# EAGLE design PL (EAGLE 9.4.2)
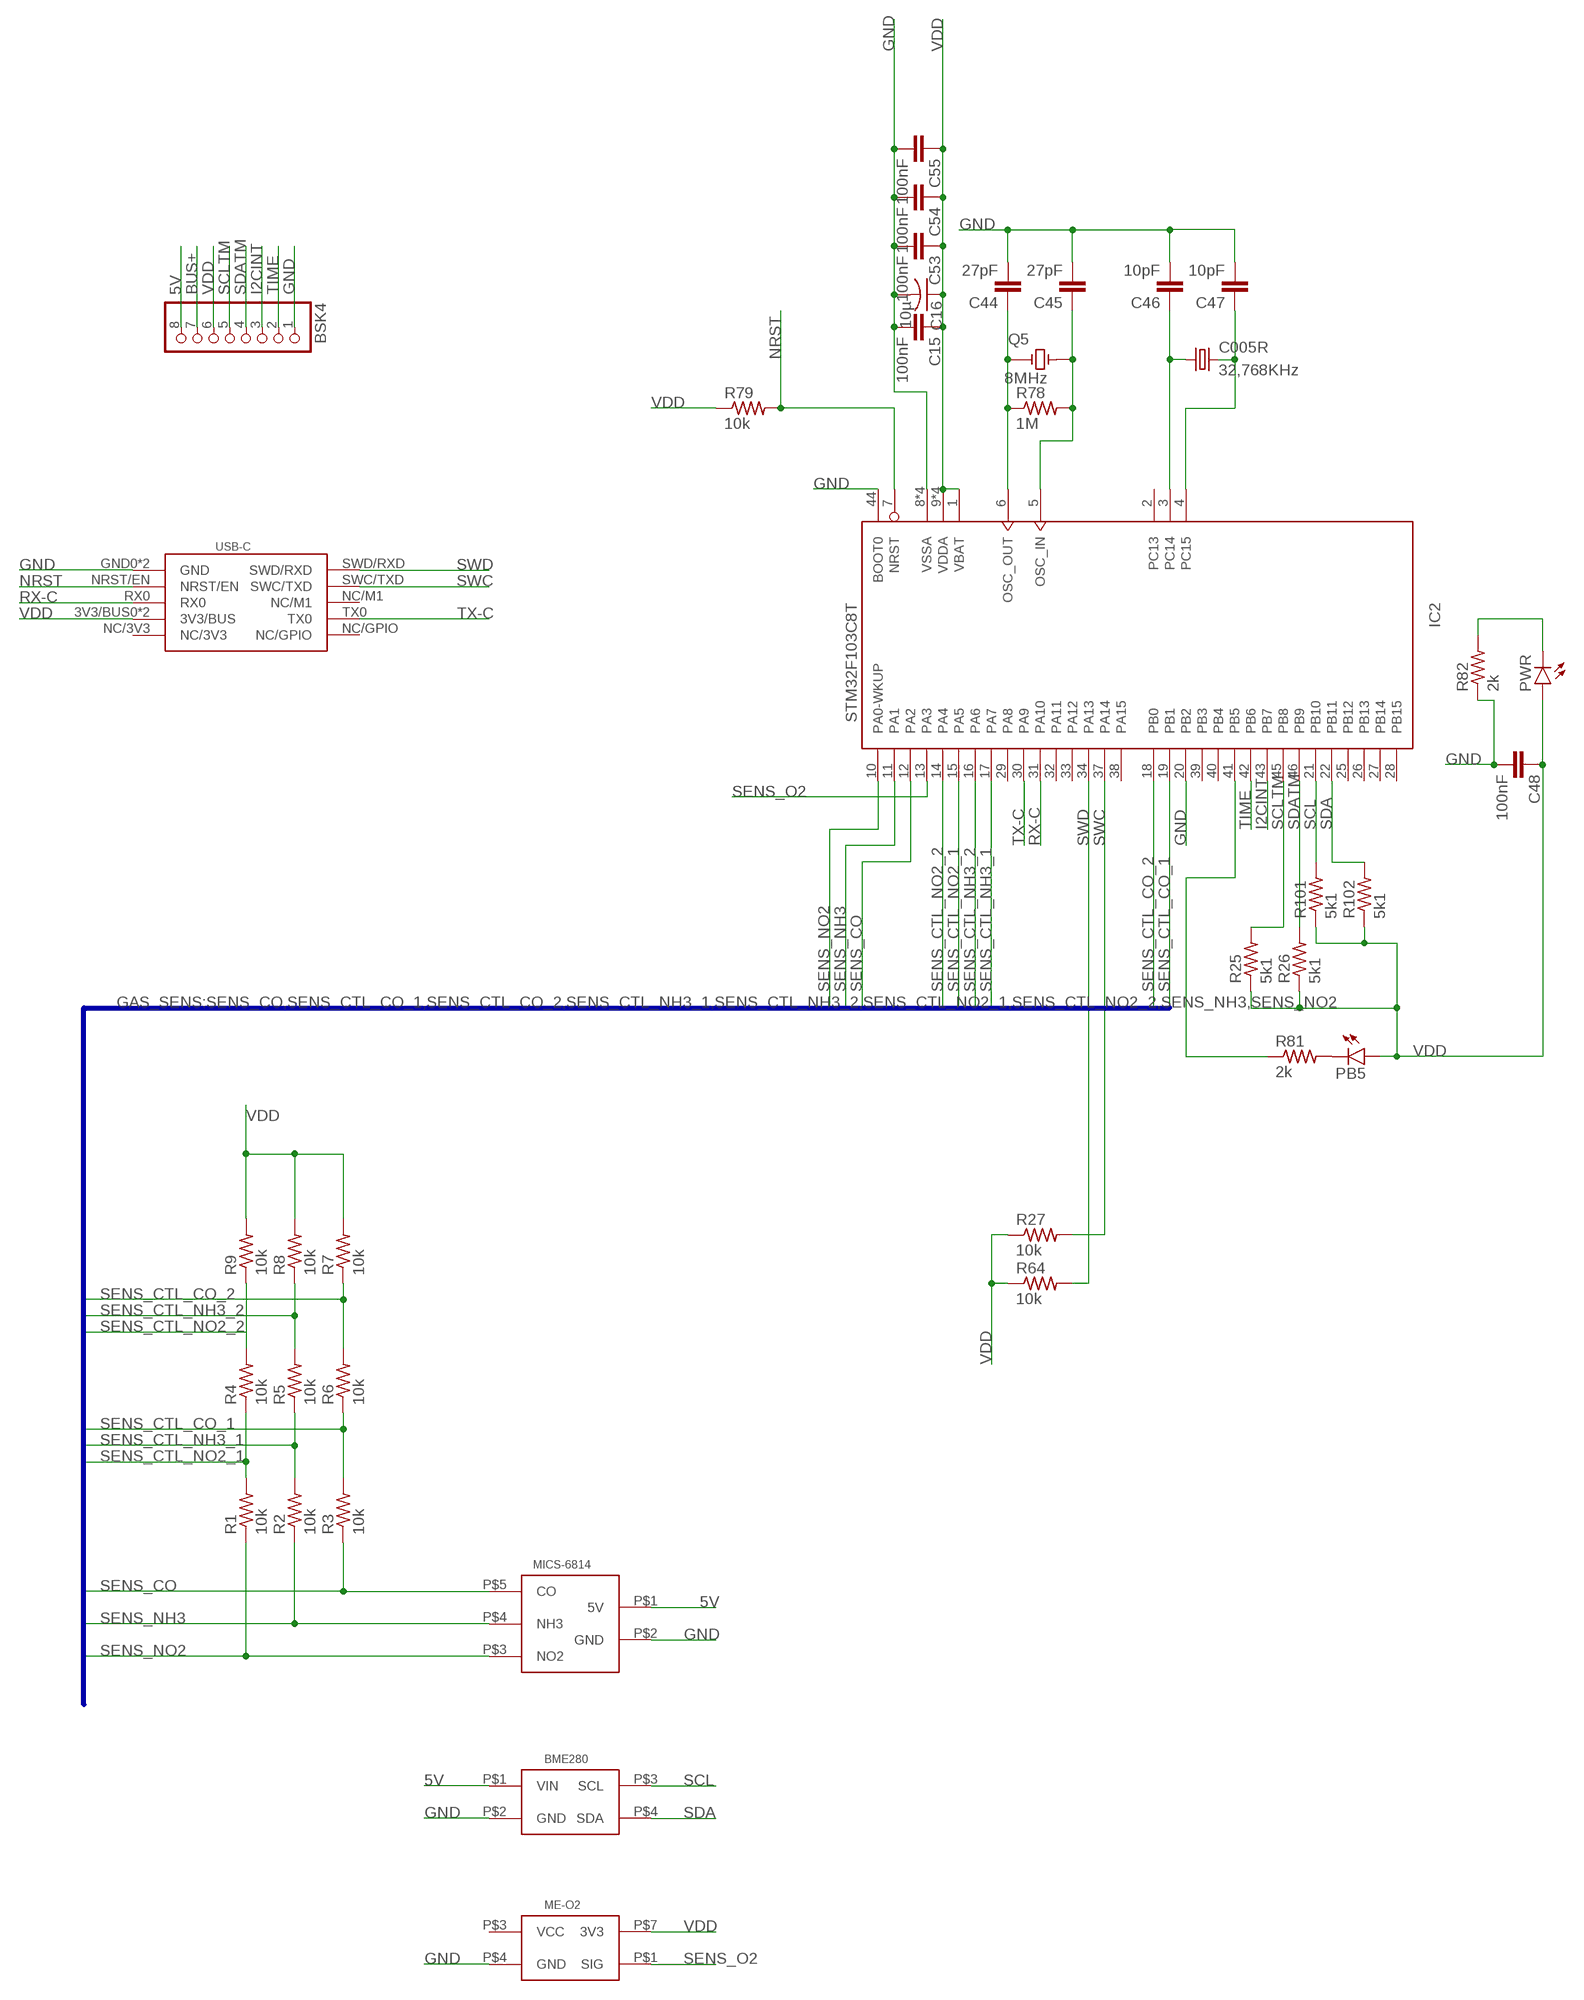
[diagram p0: schematic, sheet 1]

## Parts
BME280  BME280  [BME280]
BSK4  PINHD-1X8  [1X08]
C005R  32,768KHz  C005R  [C005R]
C15  100nF  C-EUC0603  [C0603]
C16  10µ  C-USC1206  [C1206]
C44  27pF  C-EUC0603  [C0603]
C45  27pF  C-EUC0603  [C0603]
C46  10pF  C-EUC0603  [C0603]
C47  10pF  C-EUC0603  [C0603]
C48  100nF  C-EUC0603  [C0603]
C53  100nF  C-EUC0603  [C0603]
C54  100nF  C-EUC0603  [C0603]
C55  100nF  C-EUC0603  [C0603]
IC2  STM32F103C8T  [LQFP48]
ME-O2  ME-O2  [ME-O2]
MICS-6814  MICS-6814  [MICS-6814]
PB5  LEDCHIPLED_0603  [CHIPLED_0603]
PWR  LEDCHIPLED_0603  [CHIPLED_0603]
Q5  8MHz  9C-8.000MEEJ-T  [XTAL_9C-8.000MEEJ-T]
R1  10k  R-US_R0603  [R0603]
R2  10k  R-US_R0603  [R0603]
R3  10k  R-US_R0603  [R0603]
R4  10k  R-US_R0603  [R0603]
R5  10k  R-US_R0603  [R0603]
R6  10k  R-US_R0603  [R0603]
R7  10k  R-US_R0603  [R0603]
R8  10k  R-US_R0603  [R0603]
R9  10k  R-US_R0603  [R0603]
R25  5k1  R-US_R0603  [R0603]
R26  5k1  R-US_R0603  [R0603]
R27  10k  R-US_R0603  [R0603]
R64  10k  R-US_R0603  [R0603]
R78  1M  R-US_R0603  [R0603]
R79  10k  R-US_R0603  [R0603]
R81  2k  R-US_R0603  [R0603]
R82  2k  R-US_R0603  [R0603]
R101  5k1  R-US_R0603  [R0603]
R102  5k1  R-US_R0603  [R0603]
USB-C  USB-C  [USB-C]

## Nets
5V: BME280.P$1(VIN) BSK4.8 MICS-6814.P$1(5V)
BUS+: BSK4.7
GND: BME280.P$2(GND) BSK4.1 C15.2 C16.2 C44.2 C45.2 C46.2 C47.2 C48.2 C53.2 C54.2 C55.2 IC2.8(VSSA) IC2.20(PB2) IC2.23(VSSA) IC2.35(VSSA) IC2.44(BOOT0) IC2.47(VSSA) ME-O2.P$4(GND) MICS-6814.P$2(GND) R82.1 USB-C.GND0(GND) USB-C.GND1(GND)
I2CINT: BSK4.3 IC2.43(PB7)
N$1: PB5.C R81.2
N$133: C44.1 IC2.6(OSC_OUT) Q5.1 R78.1
N$145: C45.1 IC2.5(OSC_IN) Q5.2 R78.2
N$148: C005R.P$2 C47.1 IC2.4(PC15)
N$152: C005R.P$1 C46.1 IC2.3(PC14)
N$159: PWR.C R82.2
N$161: IC2.41(PB5) R81.1
NRST: IC2.7(NRST) R79.2 USB-C.NRST/EN
RX-C: IC2.31(PA10) USB-C.RX0
SCL: BME280.P$3(SCL) IC2.21(PB10) R101.2
SCLTM: BSK4.5 IC2.45(PB8) R25.2
SDA: BME280.P$4(SDA) IC2.22(PB11) R102.2
SDATM: BSK4.4 IC2.46(PB9) R26.2
SENS_CO: IC2.12(PA2) MICS-6814.P$5(CO) R3.1
SENS_CTL_CO_1: IC2.19(PB1) R3.2 R6.1
SENS_CTL_CO_2: IC2.18(PB0) R6.2 R7.1
SENS_CTL_NH3_1: IC2.17(PA7) R2.2 R5.1
SENS_CTL_NH3_2: IC2.16(PA6) R5.2 R8.1
SENS_CTL_NO2_1: IC2.15(PA5) R1.2 R4.1
SENS_CTL_NO2_2: IC2.14(PA4) R4.2 R9.1
SENS_NH3: IC2.11(PA1) MICS-6814.P$4(NH3) R2.1
SENS_NO2: IC2.10(PA0-WKUP) MICS-6814.P$3(NO2) R1.1
SENS_O2: IC2.13(PA3) ME-O2.P$1(SIG)
SWC: IC2.37(PA14) R27.2 USB-C.SWC/TXD
SWD: IC2.34(PA13) R64.2 USB-C.SWD/RXD
TIME: BSK4.2 IC2.42(PB6)
TX-C: IC2.30(PA9) USB-C.TX0
VDD: BSK4.6 C15.1 C16.1 C48.1 C53.1 C54.1 C55.1 IC2.1(VBAT) IC2.9(VDDA) IC2.24(VDDA) IC2.36(VDDA) IC2.48(VDDA) ME-O2.P$7(3V3) PB5.A PWR.A R7.2 R8.2 R9.2 R25.1 R26.1 R27.1 R64.1 R79.1 R101.1 R102.1 USB-C.3V3/BUS0(3V3/BUS) USB-C.3V3/BUS1(3V3/BUS)
Unconnected: IC2.2(PC13) IC2.25(PB12) IC2.26(PB13) IC2.27(PB14) IC2.28(PB15) IC2.29(PA8) IC2.32(PA11) IC2.33(PA12) IC2.38(PA15) IC2.39(PB3) IC2.40(PB4) ME-O2.P$3(VCC) USB-C.NC/3V3 USB-C.NC/GPIO USB-C.NC/M1

## Buses
GAS_SENS:SENS_CO,SENS_CTL_CO_1,SENS_CTL_CO_2,SENS_CTL_NH3_1,SENS_CTL_NH3_2,SENS_CTL_NO2_1,SENS_CTL_NO2_2,SENS_NH3,SENS_NO2

## Library data of the parts
BME280 = CanCubeSat:BME280
BSK4 = pinheadCS:PINHD-1X8: PIN HEADER
C005R = CanCubeSat:C005R
C15 C44-C48 C53-C55 = rcl:C-EU: CAPACITOR, European symbol; SPICEPREFIX: C
C16 = rcl:C-US: CAPACITOR, American symbol; SPICEPREFIX: C
IC2 = CanCubeSat:STM32F103C*T: ARM 32-bit Cortex™-M3 CPU 72 MHz maximum frequency 16 to 128 Kbytes of Flash memory 6 to 20 kbytes of SRAM 37 GPIOs 2.0 to 3.6 V application supply
ME-O2 = CanCubeSat:ME-O2
MICS-6814 = CanCubeSat:MICS-6814
PB5 PWR = led:LED: LED OSRAM: - CHIPLED LG R971, LG N971, LY N971, LG Q971, LY Q971, LO R971, LY R971 LH N974, LH R974 LS Q976, LO Q976, LY Q976 LO Q996 - Hyper CHIPLED LW Q18S LB Q993, LB Q99A, LB R99A - SideLED LS A670, LO A670, LY A670, LG A670, LP A670 LB A673, LV A673, LT A673, LW A673 LH A674 LY A675 LS A676, LA A676, LO A676, LY A676, LW A676 LS A679, LY A679, LG A679 - Hyper Micro SIDELED® LS Y876, LA Y876, LO Y876, LY Y876 LT Y87S - SmartLED LW L88C, LW L88S LB L89C, LB L89S, LG L890 LS L89K, LO L89K, LY L89K LS L896, LA L896, LO L896, LY L896 - TOPLED LS T670, LO T670, LY T670, LG T670, LP T670 LSG T670, LSP T670, LSY T670, LOP T670, LYG T670 LG T671, LOG T671, LSG T671 LB T673, LV T673, LT T673, LW T673 LH T674 LS T676, LA T676, LO T676, LY T676, LB T676, LH T676, LSB T676, LW T676 LB T67C, LV T67C, LT T67C, LS T67K, LO T67K, LY T67K, LW E67C LS E67B, LA E67B, LO E67B, LY E67B, LB E67C, LV E67C, LT E67C LW T67C LS T679, LY T679, LG T679 LS T770, LO T770, LY T770, LG T770, LP T770 LB T773, LV T773, LT T773, LW T773 LH T774 LS E675, LA E675, LY E675, LS T675 LS T776, LA T776, LO T776, LY T776, LB T776 LHGB T686 LT T68C, LB T68C - Hyper Mini TOPLED® LB M676 - Mini TOPLED Santana® LG M470 LS M47K, LO M47K, LY M47K Source: http://www.osram.convergy.de LUXEON: - LUMILED® LXK2-PW12-R00, LXK2-PW12-S00, LXK2-PW14-U00, LXK2-PW14-V00 LXK2-PM12-R00, LXK2-PM12-S00, LXK2-PM14-U00 LXK2-PE12-Q00, LXK2-PE12-R00, LXK2-PE12-S00, LXK2-PE14-T00, LXK2-PE14-U00 LXK2-PB12-K00, LXK2-PB12-L00, LXK2-PB12-M00, LXK2-PB14-N00, LXK2-PB14-P00, LXK2-PB14-Q00 LXK2-PR12-L00, LXK2-PR12-M00, LXK2-PR14-Q00, LXK2-PR14-R00 LXK2-PD12-Q00, LXK2-PD12-R00, LXK2-PD12-S00 LXK2-PH12-R00, LXK2-PH12-S00 LXK2-PL12-P00, LXK2-PL12-Q00, LXK2-PL12-R00 Source: www.luxeon.com KINGBRIGHT: KA-3528ASYC Source: www.kingbright.com
Q5 = 9C-8.000MEEJ-T:9C-8.000MEEJ-T: Crystal, 8mhz, 18pf, Hc-49s; AVAILABILITY: Unavailable; DESCRIPTION: Crystal, 8mhz, 18pf, Hc-49s; MF: TXC CORPORATION; MP: 9C-8.000MEEJ-T; PACKAGE: HC49/US TXC; PRICE: None
R1-R9 R25-R27 R64 R78 R79 R81 R82 R101 R102 = resistor:R-US_: RESISTOR, American symbol
USB-C = CanCubeSat:USB-C

## Board
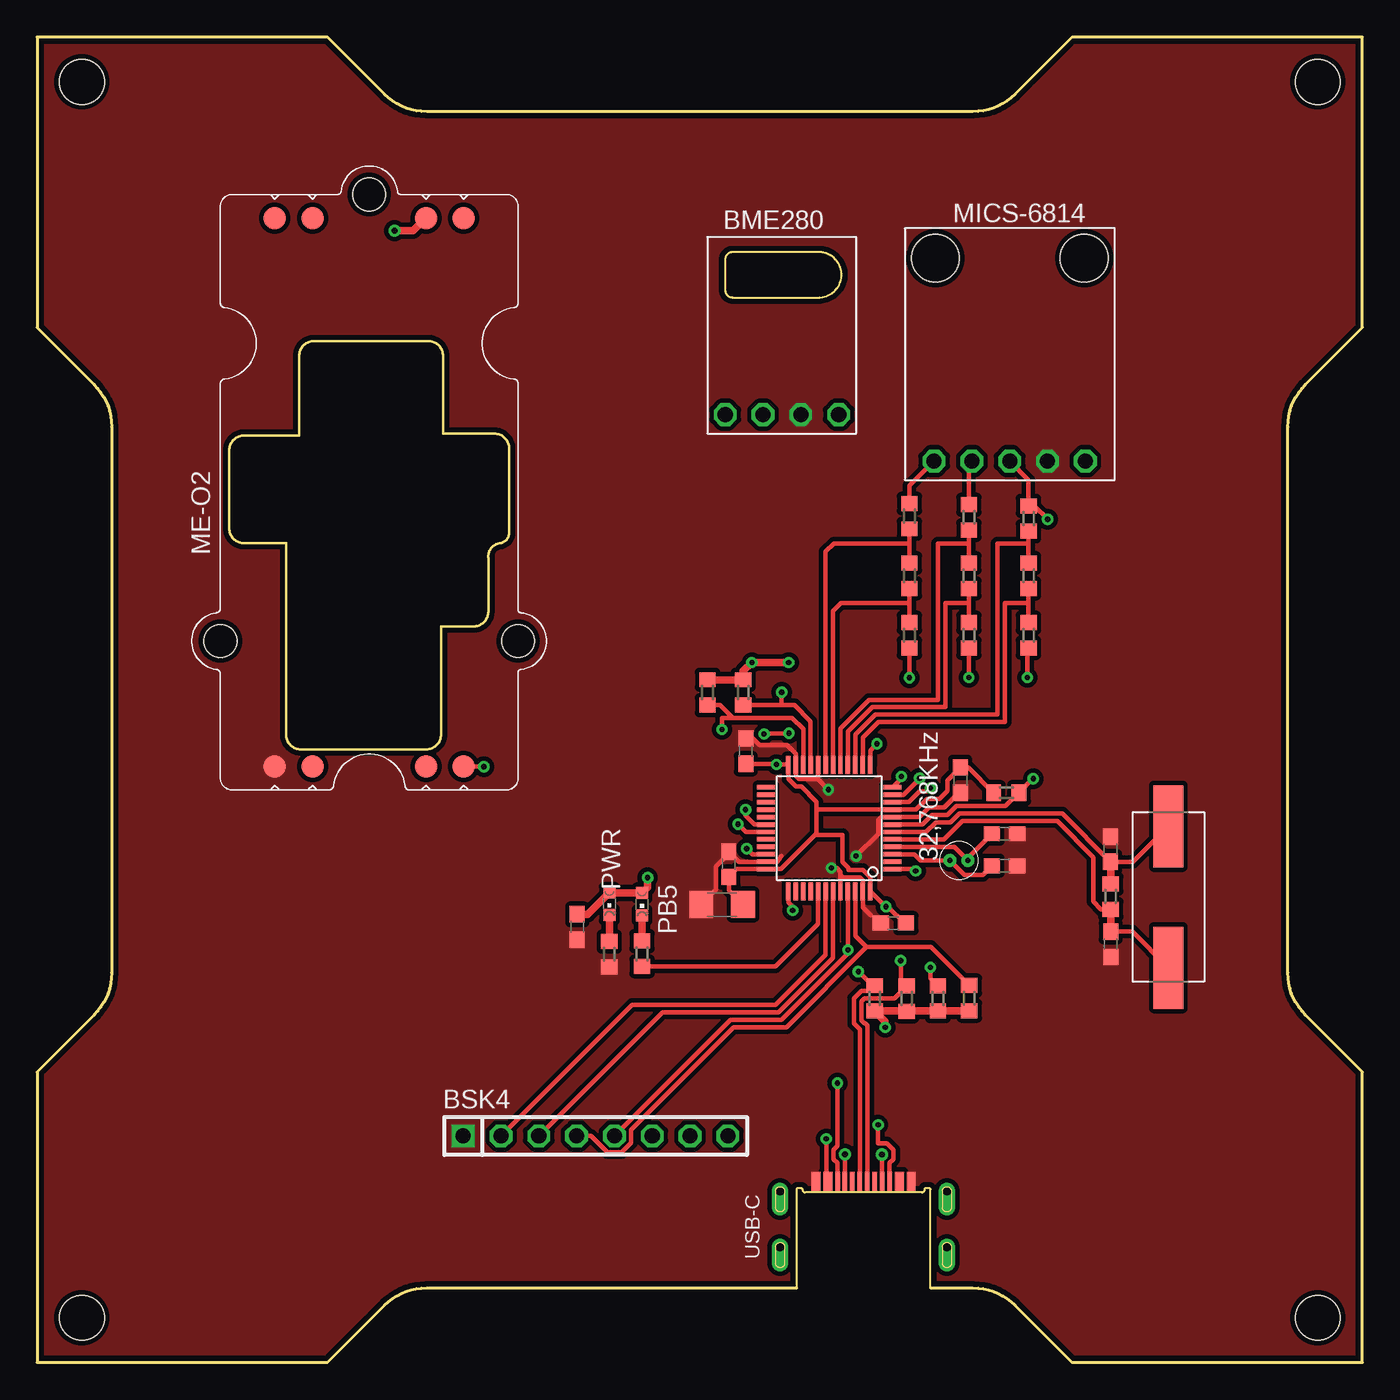
[diagram p1: board, top side]
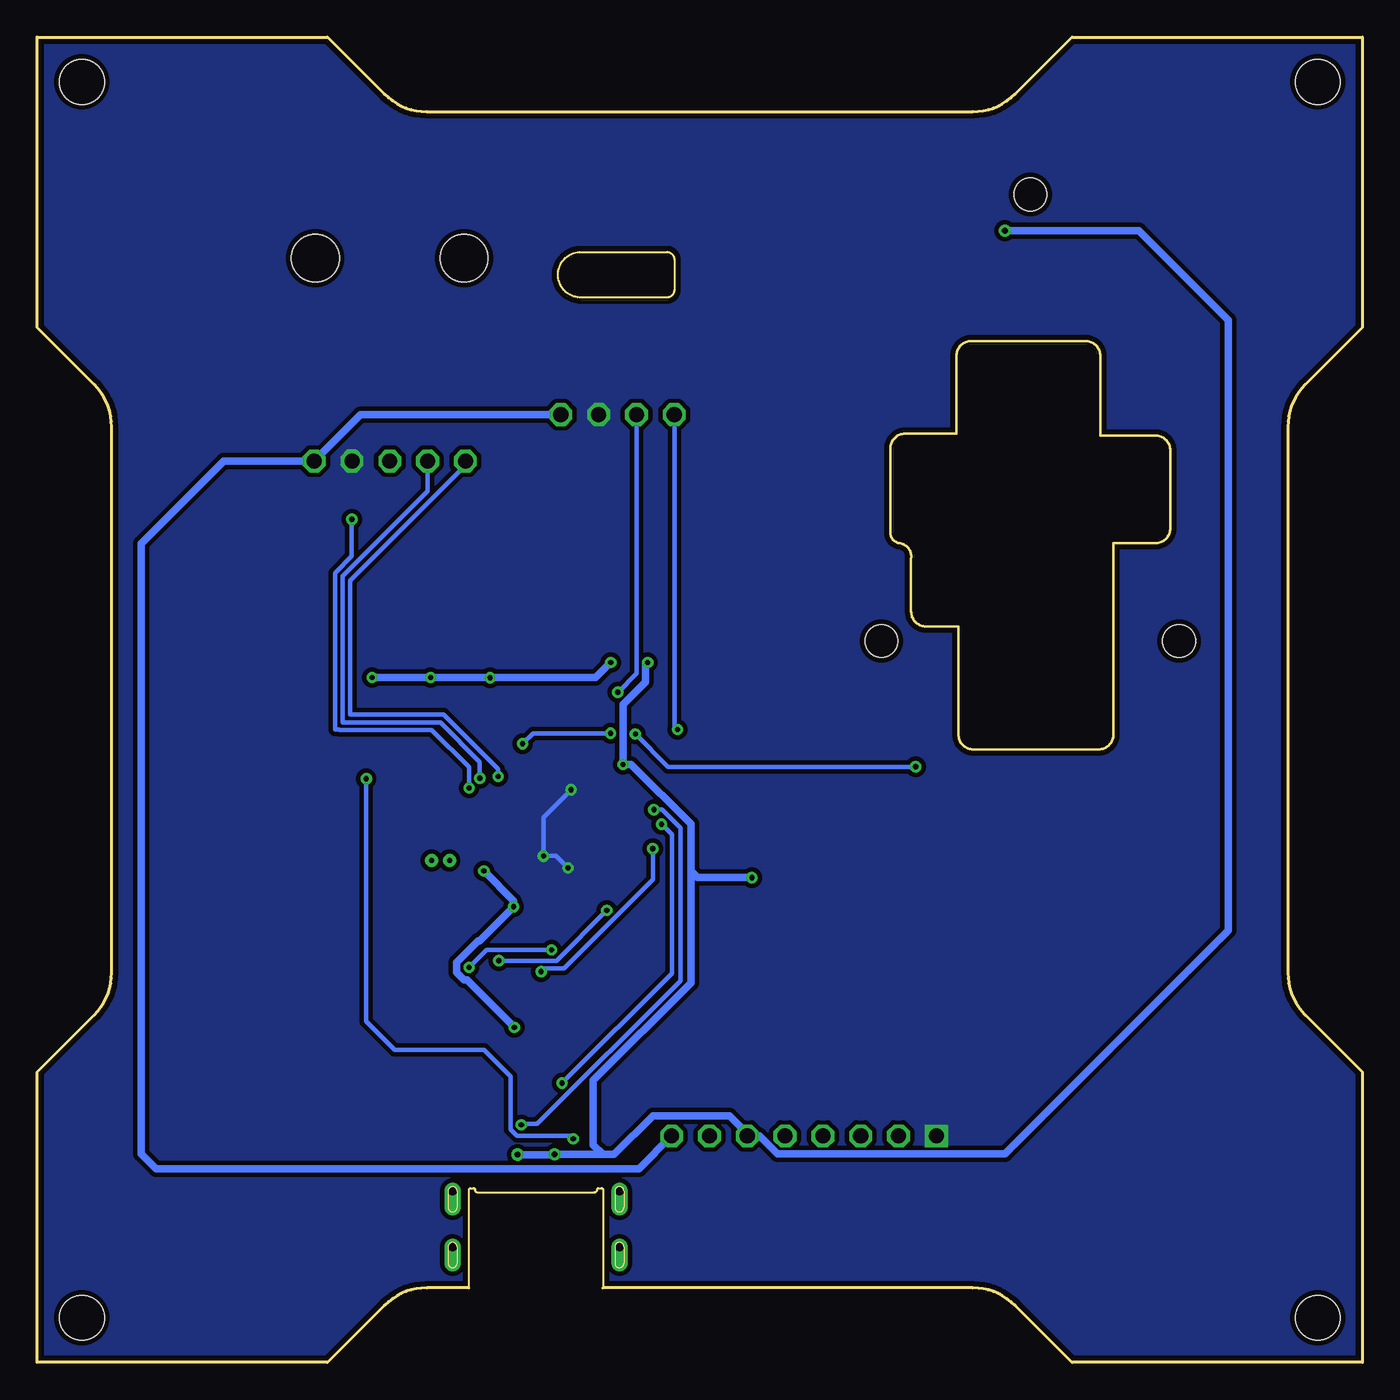
[diagram p2: board, bottom side, seen from below]

Size 89 x 89 mm. Coordinates in mm from the lower left corner, seen from the top.
Outline: 51,5 26.16,5 arc45 23.33,3.83 19.5,0 0,0 0,19.5 3.83,23.33 arc45 5,26.16 5,62.84 arc45 3.83,65.67 0,69.5 0,89 19.5,89 23.33,85.17 arc45 26.16,84 62.84,84 arc45 65.67,85.17 69.5,89 89,89 89,69.5 85.17,65.67 arc45 84,62.84 84,26.16 arc45 85.17,23.33 89,19.5 89,0 69.5,0 65.67,3.83 arc45 62.84,5 60,5
Copper layers (1*16): Top 0.035mm / dielectric 1.5mm / Bottom 0.035mm
Design rules "default *": minimum track width 0.3mm, minimum drill 0.35mm, track to track 0.2mm, track to pad 0.2mm, pad to pad 0.2mm, via to via 0.2mm, smd to smd 0.2mm, copper to edge 0.35mm, drill to drill 6mil, minimum pad ring 10mil, minimum via ring 8mil, stop-mask expansion 2mil, vias tented up to drill 0mil, thermal gap 10mil
Holes 3 mm at 3,3 86,3 86,86 3,86

### Footprints (pad centres in the part's own frame; a part is rotated, then mirrored left to right if it is on the bottom)
BME280 = drill 1.016 octagon: P$1 -3.81,5.33; P$2 -1.27,5.33; P$3 1.27,5.33; P$4 3.81,5.33
1X08 = drill 1.016 square: 1 -8.89,0 | drill 1.016 octagon: 2 -6.35,0; 3 -3.81,0; 4 -1.27,0; 5 1.27,0; 6 3.81,0; 7 6.35,0; 8 8.89,0
C005R = drill 0.35 pad 0.85: P$1 0,0.6; P$2 0,-0.6
C0603 = smd 1.1 x 1: 1 -0.85,0; 2 0.85,0
C1206 = smd 1.6 x 1.8: 1 -1.4,0; 2 1.4,0
LQFP48 = smd 0.3 x 1.2: 1 -2.75,-4.25; 2 -2.25,-4.25; 3 -1.75,-4.25; 4 -1.25,-4.25; 5 -0.75,-4.25; 6 -0.25,-4.25; 7 0.25,-4.25; 8 0.75,-4.25; 9 1.25,-4.25; 10 1.75,-4.25; 11 2.25,-4.25; 12 2.75,-4.25; 25 2.75,4.25; 26 2.25,4.25; 27 1.75,4.25; 28 1.25,4.25; 29 0.75,4.25; 30 0.25,4.25; 31 -0.25,4.25; 32 -0.75,4.25; 33 -1.25,4.25; 34 -1.75,4.25; 35 -2.25,4.25; 36 -2.75,4.25 | smd 1.2 x 0.3: 13 4.25,-2.75; 14 4.25,-2.25; 15 4.25,-1.75; 16 4.25,-1.25; 17 4.25,-0.75; 18 4.25,-0.25; 19 4.25,0.25; 20 4.25,0.75; 21 4.25,1.25; 22 4.25,1.75; 23 4.25,2.25; 24 4.25,2.75; 37 -4.25,2.75; 38 -4.25,2.25; 39 -4.25,1.75; 40 -4.25,1.25; 41 -4.25,0.75; 42 -4.25,0.25; 43 -4.25,-0.25; 44 -4.25,-0.75; 45 -4.25,-1.25; 46 -4.25,-1.75; 47 -4.25,-2.25; 48 -4.25,-2.75
ME-O2 = smd 1.524 x 1.524: P$1 -18.415,-6.35; P$2 -18.415,-3.81; P$3 -18.415,3.81; P$4 -18.415,6.35; P$5 18.415,6.35; P$6 18.415,3.81; P$7 18.415,-3.81; P$8 18.415,-6.35 | hole 2.2: -10,-10; -10,10; 20,0
MICS-6814 = drill 1.016 octagon: P$1 -5.08,7.18; P$2 -2.54,7.18; P$3 0,7.18; P$4 2.54,7.18; P$5 5.08,7.18 | hole 3.2: -5,-6.45; 5,-6.45
CHIPLED_0603 = smd 0.8 x 0.8: A 0,-0.75; C 0,0.75
XTAL_9C-8.000MEEJ-T = smd 5.5 x 2: 1 -4.75,0; 2 4.75,0
R0603 = smd 1 x 1.1: 1 -0.85,0; 2 0.85,0
USB-C = smd 0.3 x 1.4: 3V3/BUS0 -1.25,7.1; 3V3/BUS1 1.25,7.1; NC/3V3 -0.75,7.1; NC/M1 0.75,7.1; RX0 -1.75,7.1; SWC/TXD 0.25,7.1; SWD/RXD -0.25,7.1; TX0 1.75,7.1 | smd 0.6 x 1.4: GND0 -3.2,7.1; GND1 3.2,7.1; NC/GPIO 2.4,7.1; NRST/EN -2.4,7.1 | drill 0.6 pad 1.1 offset: P$13 -5.6,6.5; P$14 -5.6,2.75; P$15 5.6,6.5; P$16 5.6,2.75

### Placement (x,y rotation side)
BME280  50.02,68.98 180 top
BSK4  37.5,15.2 0 top
C005R  61.91,33.7 90 top
C15  47.6,41.05 90 top
C16  46,30.75 180 top
C44  72.08,34.46 90 top
C45  72.1,28.08 270 top
C46  64.97,33.35 0 top
C47  64.97,35.5 0 top
C48  36.27,29.24 270 top
C53  46.45,33.45 90 top
C54  62,39.1 270 top
C55  57.5,29.5 180 top
IC2  53.2,35.87 90 top
ME-O2  22.3,58.44 90 top
MICS-6814  65.32,67.71 180 top
PB5  40.62,30.77 180 top
PWR  38.43,30.81 180 top
Q5  75.98,31.25 270 top
R1  66.58,56.67 270 top
R2  62.58,56.75 270 top
R3  58.58,56.83 270 top
R4  66.58,52.83 270 top
R5  62.58,52.83 270 top
R6  58.58,52.83 270 top
R7  58.58,48.83 270 top
R8  62.58,48.83 270 top
R9  66.58,48.83 270 top
R25  60.5,24.44 90 top
R26  62.6,24.46 90 top
R27  58.4,24.43 90 top
R64  56.25,24.45 90 top
R78  72.1,31.28 270 top
R79  65.09,38.25 0 top
R81  40.62,27.44 90 top
R82  38.42,27.41 90 top
R101  47.42,44.99 270 top
R102  45.02,44.99 270 top
USB-C  55.5,5 0 top

### Tracks (layer width: path | path; a pad name or v marks a point on that pad's centre or on a via)
5V
  Bottom 0.5: BSK4.8 48.59,13 81,13 82,14 82,55 76.47,60.53 MICS-6814.P$1 67.28,63.65 BME280.P$1
GND  (via drill 0.35)
  Top 0.3: 56,30 55.45,30.55 IC2.47 55.45,32.37 55.24,32.57 54.16,32.57 53.95,32.37 | 52.24,39.17 52.45,39.38 IC2.20 | 52.24,39.17 51.16,39.17 50.95,39.38 IC2.23 50.95,40.87 50.34,41.47 48.52,41.47 48.09,41.9 C15.2 | 50,34 49.9,33.9 49.9,33.83 49.7,33.62 IC2.35 47.13,33.62 C53.2 46.45,34.15 45.6,33.3 45.6,31.75 C16.2 | IC2.44 53.95,32.37 | 53.95,32.37 53.95,32.95 53.7,33.2 v53.35,33.2 | v55,34 56.5,35.5 56.5,36.41 56.7,36.62 IC2.8 59.24,36.62 59.89,37.27 60.94,37.27 61.92,38.25 C54.2 | v53.15,38.45 52.43,39.17 52.24,39.17
  Bottom 0.3: v53.35,33.2 54.15,34 v55,34 55,36.6 v53.15,38.45
  pour Top (isolate 0.3, no thermals): -0.05,89.05 19.85,89.05 24.75,84.15 64.2,84.15 69.1,89.05 88.95,89.05 88.95,69.45 84.25,64.75 84.25,64.15 83.95,63.85 83.95,25.25 84.35,24.85 89,19.48 89,0 69.5,0 65.05,4.45 64.55,4.45 64.15,4.85 63.65,4.85 63.45,5.05 25.37,5.05 20.27,-0.05 0.25,-0.05 0.05,0.15 0.05,19.65 4.15,23.75 4.15,23.95 4.65,24.45 4.65,24.95 4.85,25.15 4.85,64.15 4.55,64.45 4.55,64.95 -0.05,69.55
  pour Bottom (isolate 0.3, no thermals): 89.05,89 69.15,89 64.25,84.1 24.8,84.1 19.9,89 0.05,89 0.05,69.4 4.75,64.7 4.75,64.1 5.05,63.8 5.05,25.2 4.65,24.8 0,19.43 0,-0.05 19.5,-0.05 23.95,4.4 24.45,4.4 24.85,4.8 25.35,4.8 25.55,5 63.63,5 68.73,-0.1 88.75,-0.1 88.95,0.1 88.95,19.6 84.85,23.7 84.85,23.9 84.35,24.4 84.35,24.9 84.15,25.1 84.15,64.1 84.45,64.4 84.45,64.9 89.05,69.5
I2CINT
  Top 0.3: BSK4.3 41.99,23.5 49.79,23.5 53.45,27.16 IC2.43
N$1
  Top 0.5: PB5.C R81.2
N$133
  Top 0.3: IC2.6 59.7,35.62 60.35,36.27 61.35,36.27 61.93,36.85 68.84,36.85 C44.1 73.59,33.61 Q5.1
  Top 0.5: R78.1 72.1,33.59 C44.1
N$145
  Top 0.3: IC2.5 60.91,35.12 62.14,36.35 68.52,36.35 70.94,33.92 70.94,30.94 71.45,30.43 R78.2 | C45.1 73.55,28.93 Q5.2
  Top 0.5: C45.1 R78.2
N$148
  Top 0.3: C47.1 62.51,33.89 C005R.P$2 61.59,34.62 IC2.4
N$152
  Top 0.3: C46.1 63.52,32.75 62.26,32.75 C005R.P$1 59.33,33.7 58.91,34.12 IC2.3
N$159
  Top 0.5: PWR.C R82.2
N$161
  Top 0.3: R81.1 49.59,26.59 52.45,29.45 IC2.41
NRST  (via drill 0.35)
  Top 0.3: v53,15 53,14.48 53,14.47 53,12.2 USB-C.NRST/EN | v66.9,39.2 v66.89,39.2 R79.2 65.04,37.35 61.73,37.35 61.15,36.77 60.1,36.77 59.45,36.12 IC2.7
  Bottom 0.3: v53,15 53.22,15.22 56.78,15.22 57.21,15.65 57.21,19.21 59,21 65,21 66.9,22.9 v66.9,39.2
RX-C  (via drill 0.35)
  Top 0.3: IC2.31 47.59,35.62 v47.07,36.14 | v53.75,18.75 53.75,14.52 53.5,14.27 53.5,13.64 53.75,13.39 USB-C.RX0
  Bottom 0.3: v47.07,36.14 46.37,35.44 46.37,26.14 v53.75,18.75
SCL  (via drill 0.35)
  Top 0.3: R101.2 50,44.14 | 50,44.14 50.86,44.14 51.95,43.05 IC2.21 | v50,45 50,44.14
  Bottom 0.3: BME280.P$3 48.75,46.25 v50,45
SCLTM  (via drill 0.35)
  Top 0.3: BSK4.5 46.57,23 50,23 54.45,27.45 v54.45,27.7 IC2.45 | R25.2 60,25.79 v60,26.52
  Bottom 0.3: v60,26.52 58.81,27.7 v54.45,27.7
SDA  (via drill 0.35)
  Top 0.3: R102.2 45.88,44.14 46.73,43.29 | 46.73,43.29 47,43.29 50.71,43.29 51.45,42.55 IC2.22 | 46.73,43.29 46,43.29 v46,42.5
  Bottom 0.3: BME280.P$4 46.21,42.71 v46,42.5
SDATM
  Top 0.3: BSK4.4 37.2,15.2 38.31,14.09 39.23,14.09 39.88,14.74 39.88,15.61 46.78,22.5 50.31,22.5 55.71,27.89 | IC2.46 54.95,28.65 55.71,27.89 | 55.71,27.89 60.02,27.89 R26.2
SENS_CO  (via drill 0.35)
  Top 0.3: MICS-6814.P$5 58.58,58.87 R3.1 | v58.05,39.35 58.05,39.22 IC2.12
  Bottom 0.3: MICS-6814.P$5 60.24,60.26 68,52.5 68,43.5 61.7,43.5 58.05,39.85 v58.05,39.35
SENS_CTL_CO_1
  Top 0.3: R3.2 58.58,55 | 58.58,55 R6.1 | IC2.19 52.95,54.45 53.5,55 58.58,55
SENS_CTL_CO_2
  Top 0.3: R6.2 58.58,51 | 58.58,51 R7.1 | IC2.18 53.45,50.45 54,51 58.58,51
SENS_CTL_NH3_1
  Top 0.3: R2.2 62.58,55 | 62.58,55 R5.1 | IC2.17 53.95,42.57 55.88,44.5 60.5,44.5 60.5,55 62.58,55
SENS_CTL_NH3_2
  Top 0.3: R5.2 62.58,51 | 62.58,51 R8.1 | IC2.16 54.45,42.36 56.09,44 61,44 61,51 62.58,51
SENS_CTL_NO2_1
  Top 0.3: R1.2 66.58,55 | 66.58,55 R4.1 | IC2.15 54.95,42.16 56.29,43.5 64.5,43.5 64.5,55 66.58,55
SENS_CTL_NO2_2
  Top 0.3: R4.2 66.58,51 | 66.58,51 R9.1 | IC2.14 55.45,41.95 56.5,43 65,43 65,51 66.58,51
SENS_NH3  (via drill 0.35)
  Top 0.3: MICS-6814.P$4 62.58,60.33 R2.1 | v59.27,39.23 58.4,38.35 58.4,38.33 58.2,38.12 IC2.11
  Bottom 0.3: v59.27,39.23 59.27,40.33 61.92,42.98 68.5,42.98 68.5,52.81 62.78,58.53 MICS-6814.P$4
SENS_NO2  (via drill 0.35)
  Top 0.3: MICS-6814.P$3 66.58,59.27 R1.1 66.97,57.52 v67.87,56.62 | v60,38.58 59.77,38.35 59.27,38.35 58.54,37.62 IC2.10
  Bottom 0.3: v67.87,56.62 67.87,54.15 69,53.02 69,42.5 68.73,42.5 68.71,42.48 62.5,42.48 60,39.98 v60,38.58
SENS_O2  (via drill 0.35)
  Top 0.3: ME-O2.P$1 29.98,40.02 v30,40 | v50.5,42.25 48.87,42.25 v48.82,42.2 | v56.4,41.55 55.95,41.1 IC2.13
  Bottom 0.3: v30,40 46.62,40 v48.82,42.2 | v56.4,41.55 55.7,42.25 v50.5,42.25
SWC  (via drill 0.35)
  Top 0.3: USB-C.SWC/TXD 55.75,22.63 55.63,22.75 55.55,22.75 55.35,22.95 55.35,24.25 55.55,24.45 57.57,24.45 R27.2 58,25.68 v58,26.97 | IC2.37 50.45,30.88 50.75,30.57 v50.75,30.35
  Bottom 0.3: v58,26.97 54.13,26.97 v50.75,30.35
SWD  (via drill 0.35)
  Top 0.3: USB-C.SWD/RXD 55.25,22.35 54.85,22.75 54.85,24.45 55.35,24.95 55.9,24.95 R64.2 56.09,25.3 v55.15,26.24 | v47.65,34.5 48.03,34.12 IC2.34
  Bottom 0.3: v55.15,26.24 54.92,26.47 53.6,26.47 47.65,32.42 v47.65,34.5
TIME
  Top 0.3: BSK4.2 39.95,24 49.59,24 52.95,27.36 IC2.42
TX-C  (via drill 0.35)
  Top 0.3: USB-C.TX0 57.25,13.38 57.5,13.64 57.5,14.26 57.06,14.7 56.48,14.7 v56.48,15.95 | IC2.30 48.18,36.12 47.58,36.72 v47.58,37.12
  Bottom 0.3: v56.48,15.95 56.43,16 55.43,16 45.8,25.63 45.8,35.9 47.02,37.12 v47.58,37.12
VDD  (via drill 0.35, 0.4)
  Top 0.3: USB-C.3V3/BUS1 v56.75,13.95 | USB-C.3V3/BUS0 v54.25,13.95 | 52.35,37.12 52.35,37.65 51.33,38.67 50.95,38.67 50.45,39.17 IC2.24 50.42,40.15 v49.65,40.15 49.6,40.2 C15.1 | 52.24,35.41 54.1,35.41 54.1,33.61 54.5,33.21 54.5,33.07 55.45,33.07 55.95,32.57 IC2.48 55.98,31.62 v57,30.6 57.15,30.6 58.25,29.5 C55.1 | 52.24,35.41 49.95,33.12 IC2.36 46.97,33.12 C53.1 46.45,31.7 C16.1 | 52.35,37.12 IC2.9 59.04,37.12 59.77,37.85 60.6,37.85 61.13,38.38 61.13,39.08 C54.1 62.54,39.95 R79.1 | 52.35,37.12 52.35,35.52 52.24,35.41 | IC2.1 58.88,33.12 v59,33 | v66.5,46 66.5,47.9 R9.2 | R8.2 v62.58,46 | v58.58,45.98 R7.2
  Top 0.5: R102.1 R101.1 47.42,46.42 v48,47 v50.48,47 | C48.1 36.96,30.09 PWR.A 38.47,31.52 PB5.A 41,31.9 v41,32.55 | R26.1 62.58,23.59 R25.1 R27.1 58.38,23.6 R64.1 56.95,22.9 v56.95,22.5 | v24,76 25.25,76 ME-O2.P$7
  Bottom 0.3: 62.48,45.98 v62.58,46
  Bottom 0.5: v56.75,13.95 v54.25,13.95 51,13.95 | 51,13.95 50.25,13.95 47.65,16.55 42.5,16.55 41.31,15.36 BSK4.6 40.48,15.2 39.27,13.99 24.01,13.99 9,29 9,70 15,76 v24,76 | 45.1,33 45.1,25.48 51.65,18.93 51.65,14.61 51,13.95 | 45.1,33 45.1,36.15 49.1,40.15 v49.65,40.15 49.65,44.18 48.15,45.68 48.15,46.85 v48,47 | v41,32.55 44.65,32.55 45.1,33 | v56.95,22.5 60.14,25.69 60.34,25.69 60.83,26.17 60.83,26.86 59.39,28.3 59.3,28.3 v57,30.6 57,31 v59,33 | v50.48,47 51.5,45.98 v58.58,45.98 62.48,45.98 | v62.58,46 v66.5,46